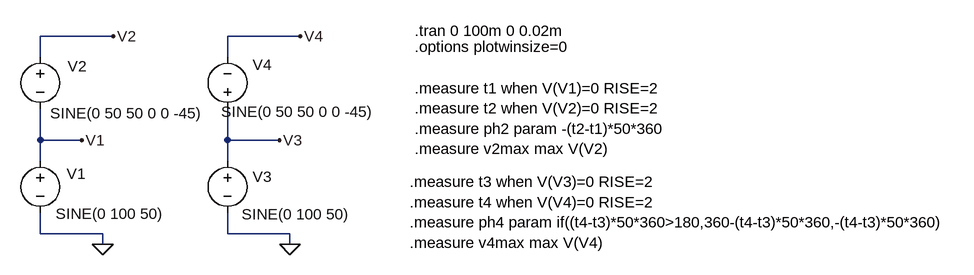
[diagram p0: schematic Phasors_meas.asc]
Phasors_meas.asc, the LTspice schematic file:
Version 4
SHEET 1 1604 872
WIRE -64 -528 -176 -528
WIRE 224 -528 112 -528
WIRE -176 -496 -176 -528
WIRE 112 -496 112 -528
WIRE -176 -368 -176 -416
WIRE -112 -368 -176 -368
WIRE 112 -368 112 -416
WIRE 192 -368 112 -368
WIRE -176 -336 -176 -368
WIRE 112 -336 112 -368
WIRE -176 -224 -176 -256
WIRE -80 -224 -176 -224
WIRE 112 -224 112 -256
WIRE 208 -224 112 -224
WIRE -80 -208 -80 -224
WIRE 208 -208 208 -224
FLAG -80 -208 0
FLAG -112 -368 V1
FLAG -64 -528 V2
FLAG 208 -208 0
FLAG 192 -368 V3
FLAG 224 -528 V4
SYMBOL voltage -176 -352 R0
WINDOW 0 41 36 Left 0
WINDOW 3 24 97 Left 0
WINDOW 123 0 0 Left 0
WINDOW 39 0 0 Left 0
SYMATTR InstName V1
SYMATTR Value SINE(0 100 50)
SYMBOL voltage -176 -512 R0
WINDOW 0 42 30 Left 0
WINDOW 3 15 103 Left 0
WINDOW 123 0 0 Left 0
WINDOW 39 0 0 Left 0
SYMATTR InstName V2
SYMATTR Value SINE(0 50 50 0 0 -45)
SYMBOL voltage 112 -352 R0
WINDOW 0 39 40 Left 0
WINDOW 3 22 98 Left 0
WINDOW 123 0 0 Left 0
WINDOW 39 0 0 Left 0
SYMATTR InstName V3
SYMATTR Value SINE(0 100 50)
SYMBOL voltage 112 -400 R180
WINDOW 0 -68 84 Left 0
WINDOW 3 -226 12 Left 0
WINDOW 123 0 0 Left 0
WINDOW 39 0 0 Left 0
SYMATTR InstName V4
SYMATTR Value SINE(0 50 50 0 0 -45)
TEXT 400 -536 Left 0 !.tran 0 100m 0 0.02m
TEXT 400 -448 Left 0 !.measure t1 when V(V1)=0 RISE=2\n.measure t2 when V(V2)=0 RISE=2\n.measure ph2 param -(t2-t1)*50*360\n.measure v2max max V(V2)
TEXT 392 -304 Left 0 !.measure t3 when V(V3)=0 RISE=2\n.measure t4 when V(V4)=0 RISE=2\n.measure ph4 param if((t4-t3)*50*360>180,360-(t4-t3)*50*360,-(t4-t3)*50*360)\n.measure v4max max V(V4)
TEXT 400 -512 Left 0 !.options plotwinsize=0

The netlist it stands for:
* Phasors_meas.asc
V1 V1 0 SINE(0 100 50)
V2 V2 V1 SINE(0 50 50 0 0 -45)
V3 V3 0 SINE(0 100 50)
V4 V3 V4 SINE(0 50 50 0 0 -45)
.tran 0 100m 0 0.02m
.measure t1 when V(V1)=0 RISE=2
.measure t2 when V(V2)=0 RISE=2
.measure ph2 param -(t2-t1)*50*360
.measure v2max max V(V2)
.measure t3 when V(V3)=0 RISE=2
.measure t4 when V(V4)=0 RISE=2
.measure ph4 param if((t4-t3)*50*360>180,360-(t4-t3)*50*360,-(t4-t3)*50*360)
.measure v4max max V(V4)
.options plotwinsize=0
.backanno
.end